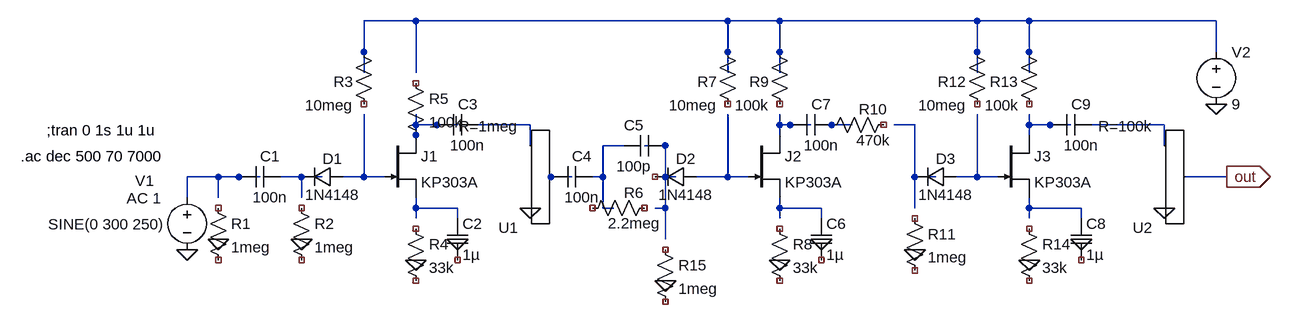
[diagram p0: schematic vulcan_jfet.asc]
vulcan_jfet.asc, the LTspice schematic file:
Version 4
SHEET 1 1776 680
WIRE 432 -96 352 -96
WIRE 912 -96 432 -96
WIRE 992 -96 912 -96
WIRE 1296 -96 992 -96
WIRE 1376 -96 1296 -96
WIRE 1664 -96 1376 -96
WIRE 1664 -48 1664 -96
WIRE 352 -16 352 -96
WIRE 432 -16 432 -96
WIRE 912 -16 912 -96
WIRE 992 -16 992 -96
WIRE 1296 -16 1296 -96
WIRE 1376 -16 1376 -96
WIRE 432 64 432 48
WIRE 496 64 432 64
WIRE 608 64 528 64
WIRE 992 64 992 48
WIRE 1040 64 992 64
WIRE 1104 64 1072 64
WIRE 1200 64 1168 64
WIRE 1376 64 1376 48
WIRE 1440 64 1376 64
WIRE 1584 64 1472 64
WIRE 432 80 432 64
WIRE 992 80 992 64
WIRE 1376 80 1376 64
WIRE 608 96 608 64
WIRE 752 96 720 96
WIRE 816 96 784 96
WIRE 1584 96 1584 64
WIRE 128 144 80 144
WIRE 192 144 128 144
WIRE 256 144 224 144
WIRE 288 144 256 144
WIRE 352 144 352 48
WIRE 352 144 320 144
WIRE 384 144 352 144
WIRE 672 144 640 144
WIRE 720 144 720 96
WIRE 720 144 704 144
WIRE 816 144 816 96
WIRE 832 144 816 144
WIRE 912 144 912 48
WIRE 912 144 864 144
WIRE 944 144 912 144
WIRE 1200 144 1200 64
WIRE 1232 144 1200 144
WIRE 1296 144 1296 48
WIRE 1296 144 1264 144
WIRE 1328 144 1296 144
WIRE 1680 144 1616 144
WIRE 80 176 80 144
WIRE 128 176 128 144
WIRE 256 176 256 144
WIRE 432 192 432 176
WIRE 496 192 432 192
WIRE 720 192 720 144
WIRE 736 192 720 192
WIRE 816 192 816 144
WIRE 816 192 800 192
WIRE 992 192 992 176
WIRE 1056 192 992 192
WIRE 1200 192 1200 144
WIRE 1376 192 1376 176
WIRE 1456 192 1376 192
WIRE 432 208 432 192
WIRE 496 208 496 192
WIRE 992 208 992 192
WIRE 1056 208 1056 192
WIRE 1376 208 1376 192
WIRE 1456 208 1456 192
WIRE 816 240 816 192
FLAG 80 256 0
FLAG 128 240 0
FLAG 256 240 0
FLAG 432 272 0
FLAG 496 240 0
FLAG 608 192 0
FLAG 992 272 0
FLAG 1056 240 0
FLAG 1200 256 0
FLAG 1376 272 0
FLAG 1456 240 0
FLAG 1584 192 0
FLAG 1680 144 out
IOPIN 1680 144 Out
FLAG 1664 32 0
FLAG 816 304 0
SYMBOL voltage 80 160 R0
WINDOW 0 -80 -10 Left 0
WINDOW 3 -214 57 Left 0
WINDOW 123 -93 17 Left 0
WINDOW 39 0 0 Left 0
SYMATTR InstName V1
SYMATTR Value SINE(0 300 250)
SYMATTR Value2 AC 1
SYMBOL cap 224 128 R90
WINDOW 0 0 16 VBottom 0
WINDOW 3 32 16 VTop 0
SYMATTR InstName C1
SYMATTR Value 100n
SYMBOL res 112 176 R0
SYMATTR InstName R1
SYMATTR Value 1meg
SYMBOL diode 320 128 R90
WINDOW 0 4 16 VBottom 0
WINDOW 3 28 16 VTop 0
SYMATTR InstName D1
SYMATTR Value 1N4148
SYMBOL res 240 176 R0
SYMATTR InstName R2
SYMATTR Value 1meg
SYMBOL njf 384 80 R0
SYMATTR InstName J1
SYMATTR Value KP303A
SYMBOL res 416 208 R0
SYMATTR InstName R4
SYMATTR Value 33k
SYMBOL cap 480 208 R0
SYMATTR InstName C2
SYMATTR Value 1µ
SYMBOL res 368 48 R180
WINDOW 0 32 50 Left 0
WINDOW 3 32 14 Left 0
SYMATTR InstName R3
SYMATTR Value 10meg
SYMBOL res 416 -16 R0
SYMATTR InstName R5
SYMATTR Value 100k
SYMBOL cap 528 48 R90
WINDOW 0 0 16 VBottom 0
WINDOW 3 32 16 VTop 0
SYMATTR InstName C3
SYMATTR Value 100n
SYMBOL EXTRA\\Misc\\pot 608 144 R180
SYMATTR InstName U1
SYMATTR Value R=1meg
SYMBOL cap 704 128 R90
WINDOW 0 0 16 VBottom 0
WINDOW 3 32 16 VTop 0
SYMATTR InstName C4
SYMATTR Value 100n
SYMBOL res 800 176 R90
WINDOW 0 8 32 VBottom 0
WINDOW 3 24 32 VTop 0
SYMATTR InstName R6
SYMATTR Value 2.2meg
SYMBOL cap 752 112 R270
WINDOW 0 32 16 VTop 0
WINDOW 3 0 16 VBottom 0
SYMATTR InstName C5
SYMATTR Value 100p
SYMBOL diode 864 128 R90
WINDOW 0 4 16 VBottom 0
WINDOW 3 28 16 VTop 0
SYMATTR InstName D2
SYMATTR Value 1N4148
SYMBOL njf 944 80 R0
SYMATTR InstName J2
SYMATTR Value KP303A
SYMBOL res 976 208 R0
SYMATTR InstName R8
SYMATTR Value 33k
SYMBOL cap 1040 208 R0
SYMATTR InstName C6
SYMATTR Value 1µ
SYMBOL res 928 48 R180
WINDOW 0 32 50 Left 0
WINDOW 3 32 14 Left 0
SYMATTR InstName R7
SYMATTR Value 10meg
SYMBOL cap 1072 48 R90
WINDOW 0 0 16 VBottom 0
WINDOW 3 32 16 VTop 0
SYMATTR InstName C7
SYMATTR Value 100n
SYMBOL res 1168 48 R90
WINDOW 0 8 32 VBottom 0
WINDOW 3 24 32 VTop 0
SYMATTR InstName R10
SYMATTR Value 470k
SYMBOL res 1184 192 R0
SYMATTR InstName R11
SYMATTR Value 1meg
SYMBOL diode 1264 128 R90
WINDOW 0 4 16 VBottom 0
WINDOW 3 28 16 VTop 0
SYMATTR InstName D3
SYMATTR Value 1N4148
SYMBOL res 1008 48 R180
WINDOW 0 32 50 Left 0
WINDOW 3 32 14 Left 0
SYMATTR InstName R9
SYMATTR Value 100k
SYMBOL res 1312 48 R180
WINDOW 0 32 50 Left 0
WINDOW 3 32 14 Left 0
SYMATTR InstName R12
SYMATTR Value 10meg
SYMBOL njf 1328 80 R0
SYMATTR InstName J3
SYMATTR Value KP303A
SYMBOL res 1392 48 R180
WINDOW 0 32 50 Left 0
WINDOW 3 32 14 Left 0
SYMATTR InstName R13
SYMATTR Value 100k
SYMBOL res 1360 208 R0
SYMATTR InstName R14
SYMATTR Value 33k
SYMBOL cap 1440 208 R0
SYMATTR InstName C8
SYMATTR Value 1µ
SYMBOL EXTRA\\Misc\\pot 1584 144 R180
SYMATTR InstName U2
SYMATTR Value R=100k
SYMBOL cap 1472 48 R90
WINDOW 0 0 16 VBottom 0
WINDOW 3 32 16 VTop 0
SYMATTR InstName C9
SYMATTR Value 100n
SYMBOL voltage 1664 -64 R0
WINDOW 123 0 0 Left 0
WINDOW 39 0 0 Left 0
SYMATTR InstName V2
SYMATTR Value 9
SYMBOL res 800 240 R0
SYMATTR InstName R15
SYMATTR Value 1meg
TEXT -136 72 Left 0 !;tran 0 1s 1u 1u
TEXT -176 112 Left 0 !.ac dec 500 70 7000

The netlist it stands for:
* vulcan_jfet.asc
V1 N011 0 SINE(0 300 250) AC 1
C1 N012 N011 100n
R1 NC_01 NC_02 1meg
D1 N013 N012 1N4148
R2 NC_03 NC_04 1meg
J1 N002 N013 N017 KP303A
R4 NC_05 NC_06 33k
C2 N017 NC_07 1µ
R3 NC_08 N001 10meg
R5 NC_09 N002 100k
C3 N003 N002 100n
XU1 0 N003 N014 R=1meg
C4 N009 N014 100n
R6 NC_10 NC_11 2.2meg
C5 N009 N010 100p
D2 N015 NC_12 1N4148
J2 N004 N015 N018 KP303A
R8 NC_13 NC_14 33k
C6 N018 NC_15 1µ
R7 NC_16 N001 10meg
C7 N005 N004 100n
R10 NC_17 N005 470k
R11 NC_18 NC_19 1meg
D3 N016 N006 1N4148
R9 NC_20 N001 100k
R12 NC_21 N001 10meg
J3 N007 N016 N019 KP303A
R13 NC_22 N001 100k
R14 NC_23 NC_24 33k
C8 N019 NC_25 1µ
XU2 0 N008 out R=100k
C9 N008 N007 100n
V2 N001 0 9
R15 NC_26 NC_27 1meg
.model D D
.lib standard.dio
.model NJF NJF
.model PJF PJF
.lib standard.jft
;tran 0 1s 1u 1u
.ac dec 500 70 7000
.lib POT.lib
.backanno
.end